# EAGLE design PSPS_AVNC_SRD_sensors-2020-09-29 (EAGLE 9.6.2)
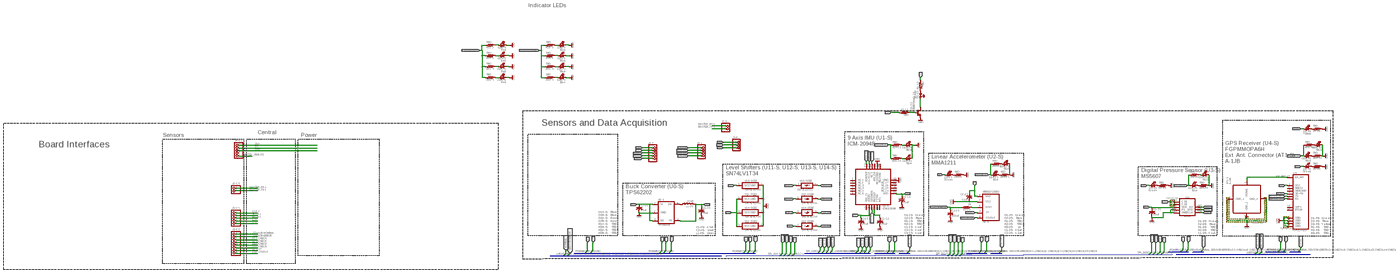
[diagram p0: schematic, sheet 1, overview]
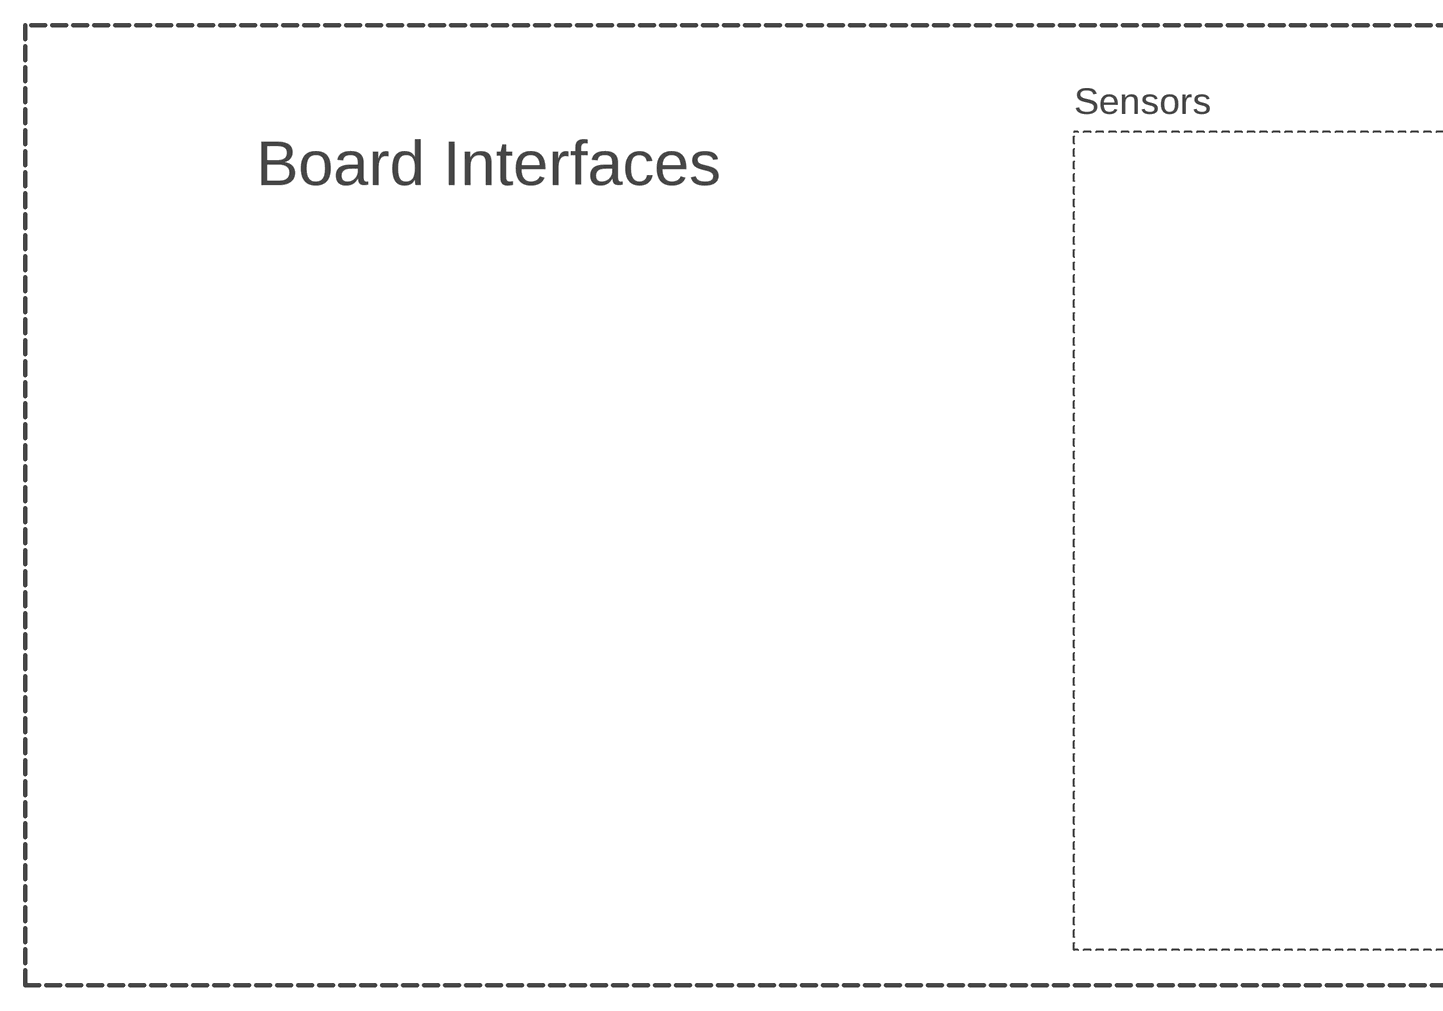
[diagram p1: schematic, sheet 1, part 1 of 4]
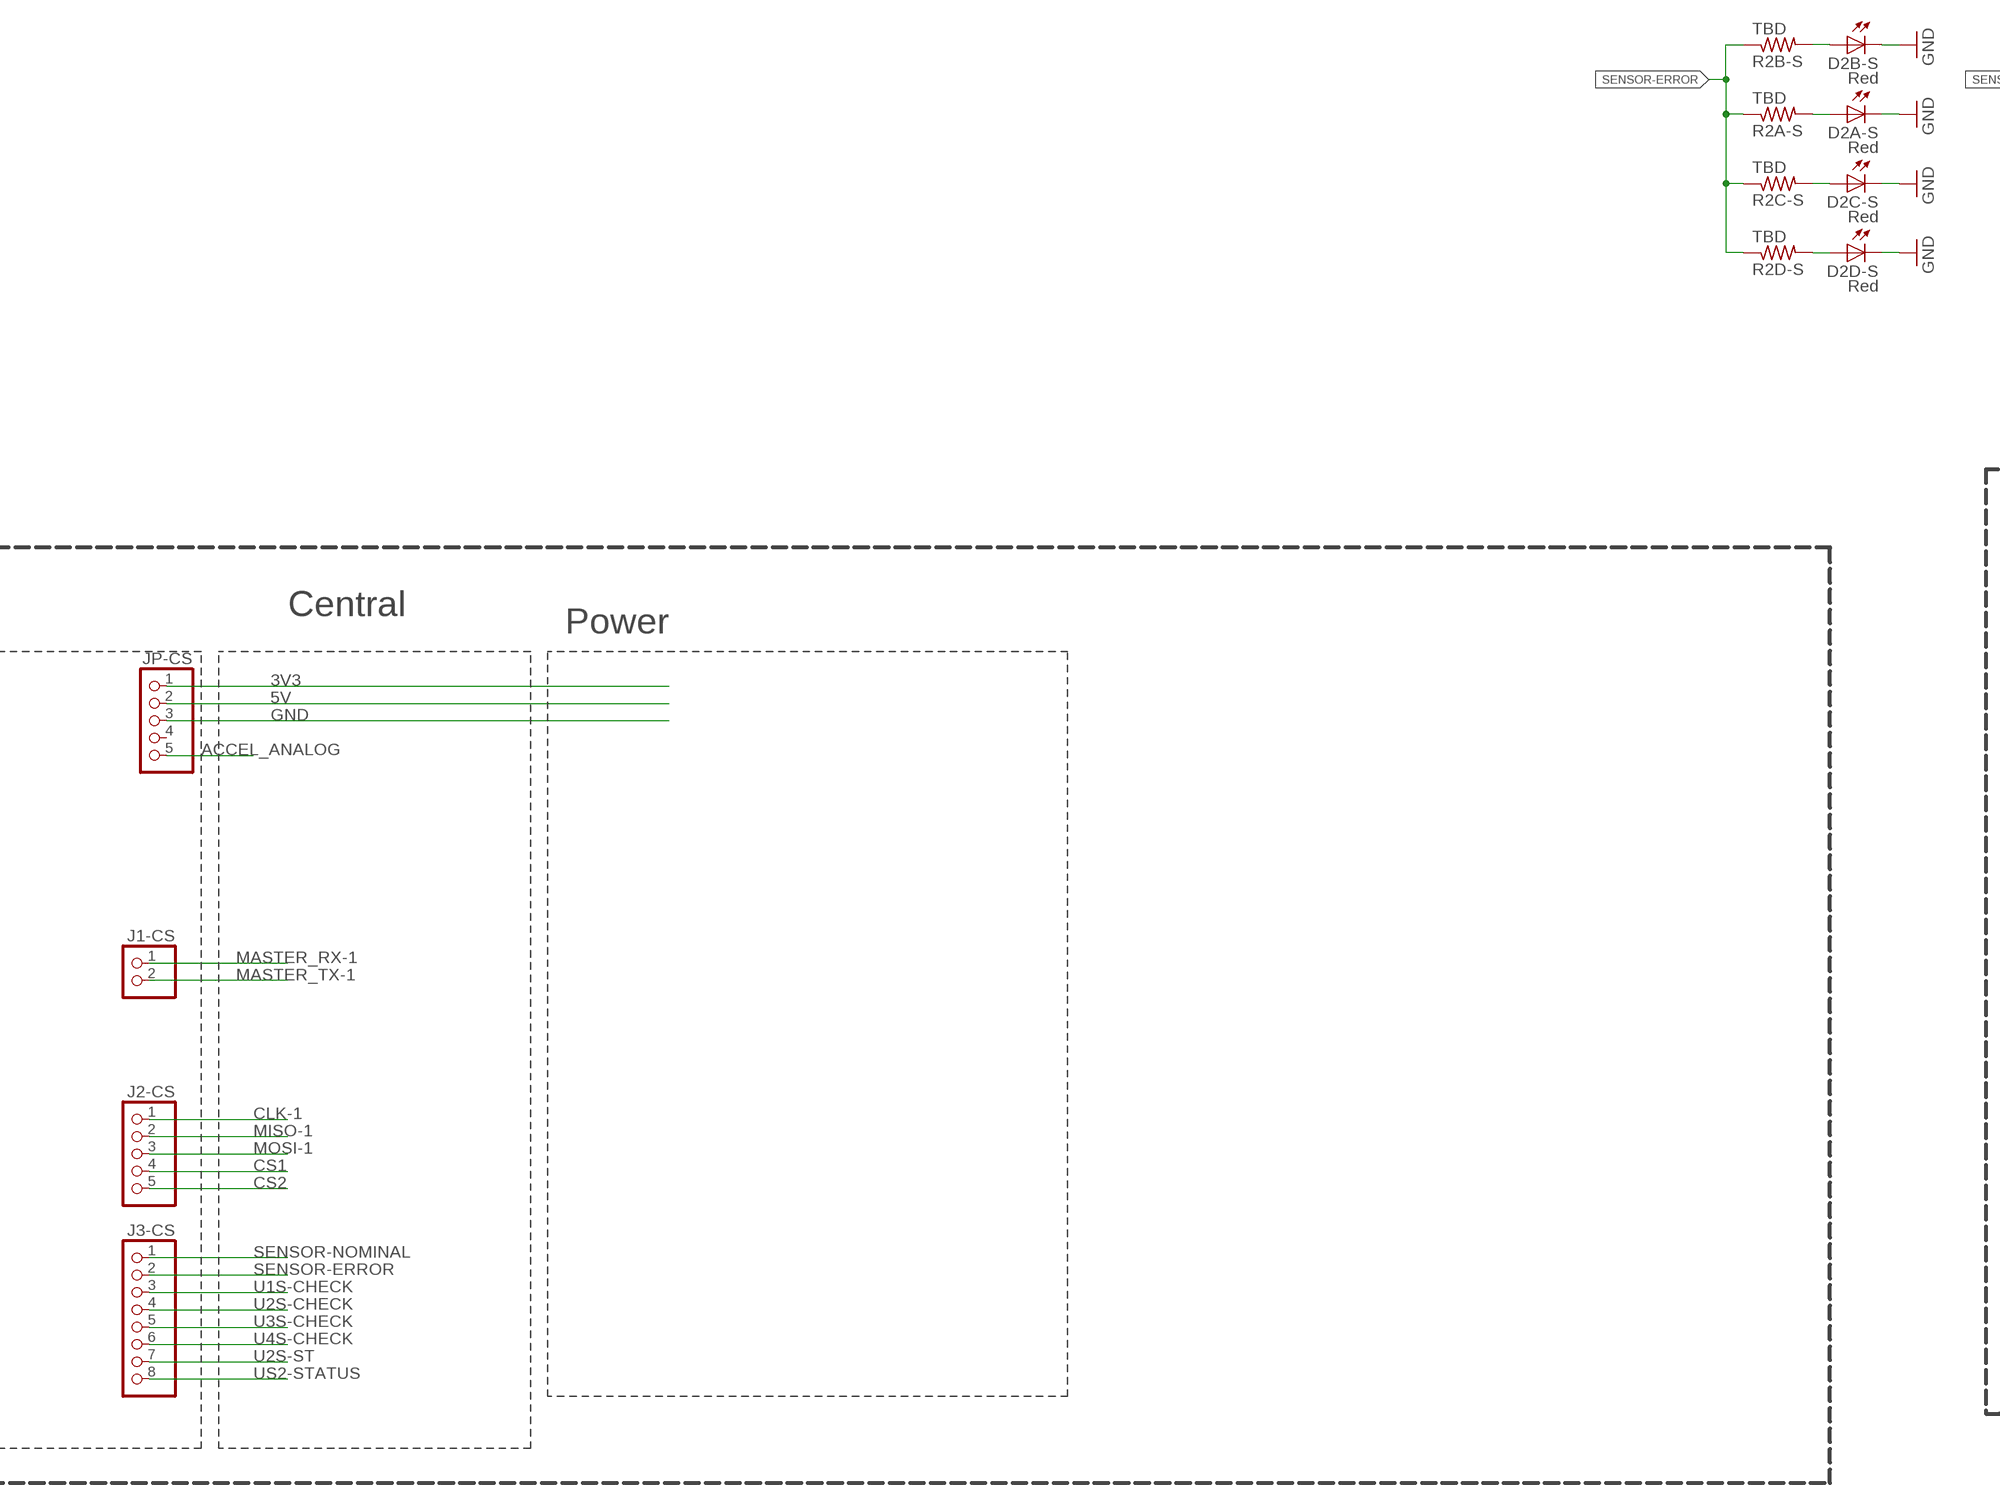
[diagram p2: schematic, sheet 1, part 2 of 4]
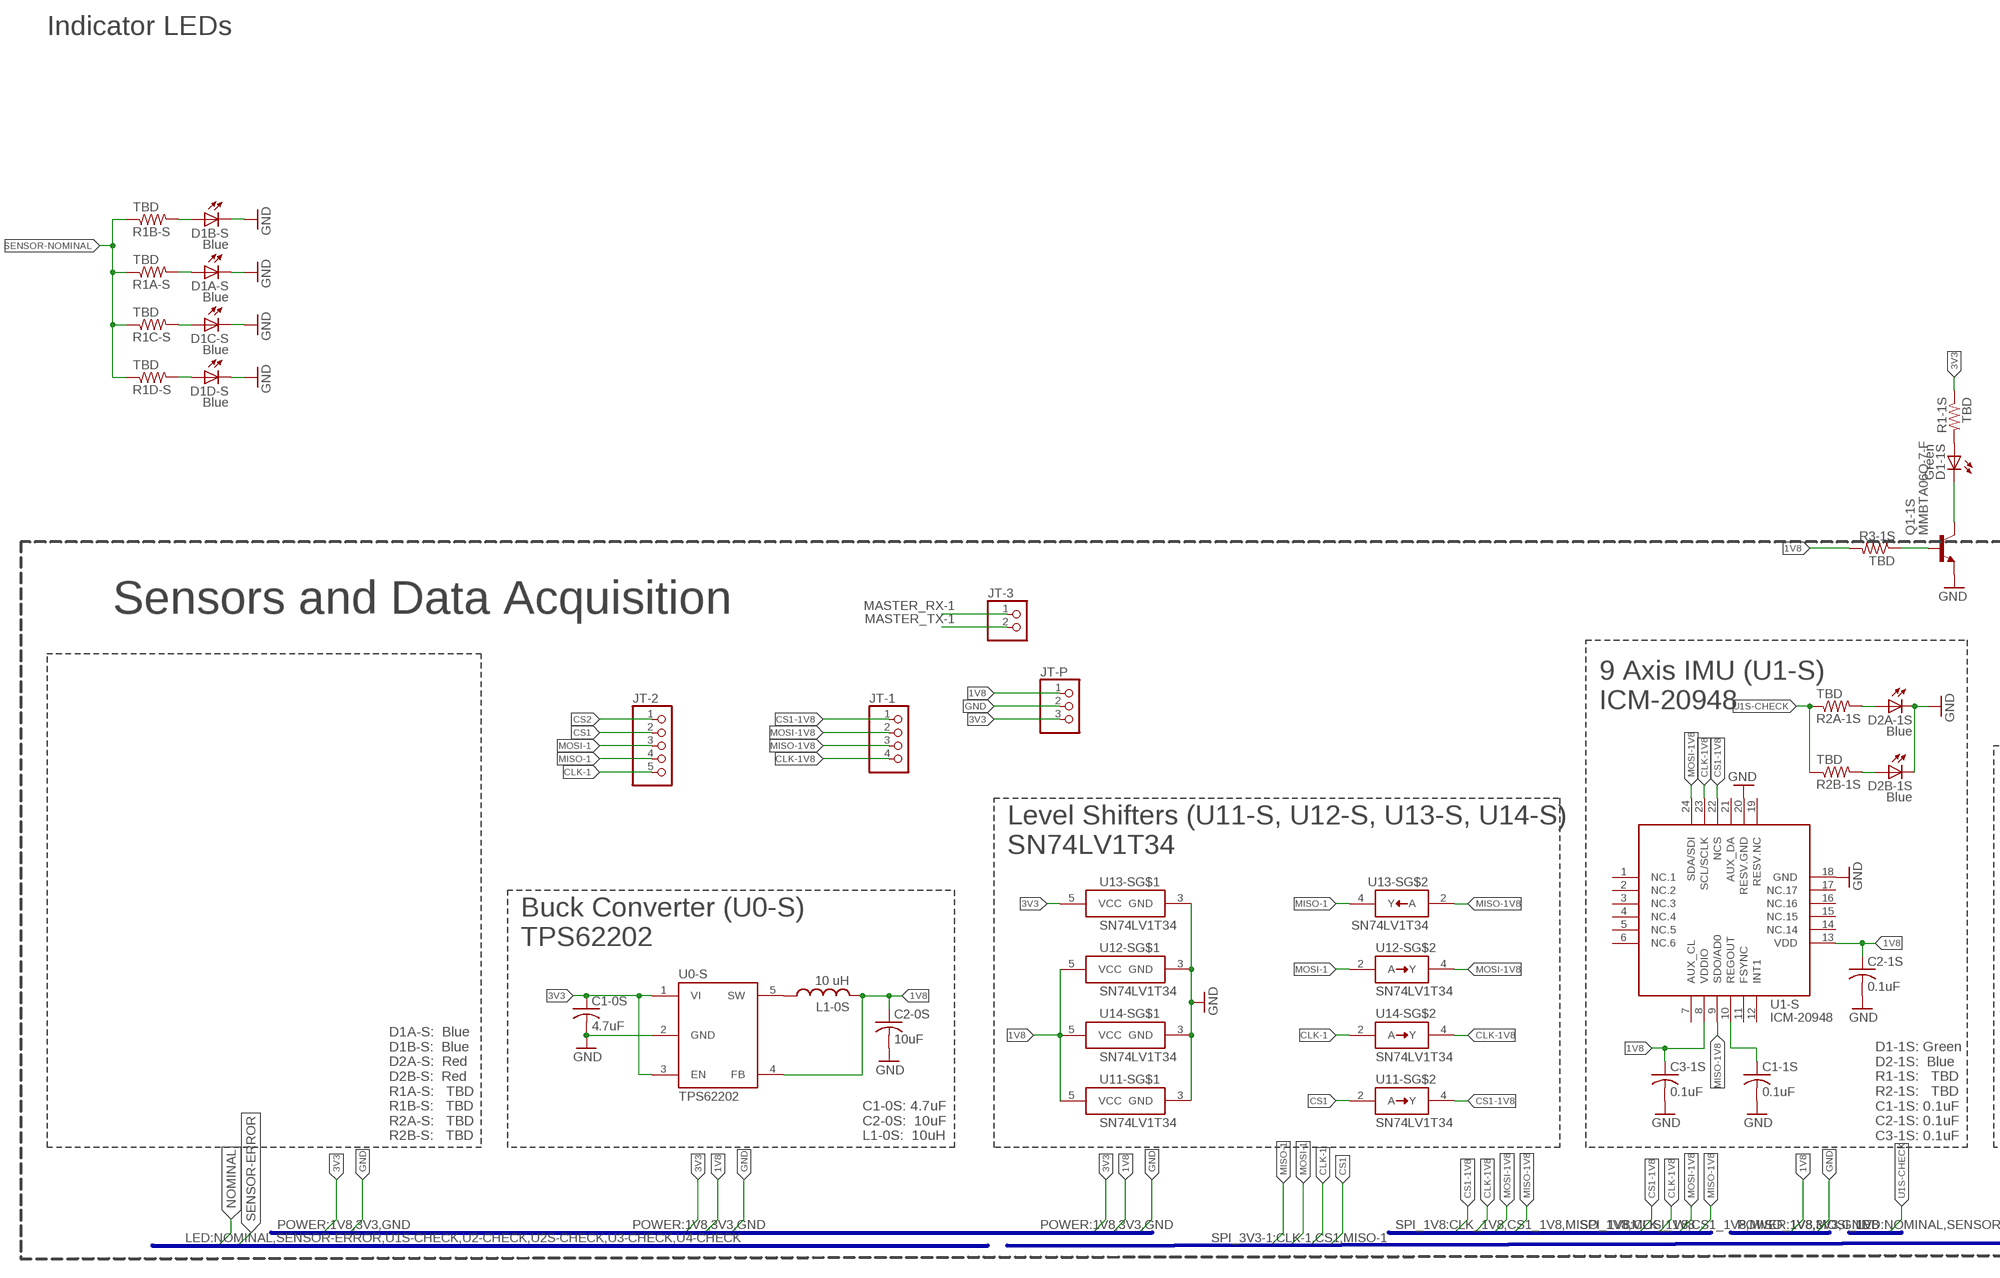
[diagram p3: schematic, sheet 1, part 3 of 4]
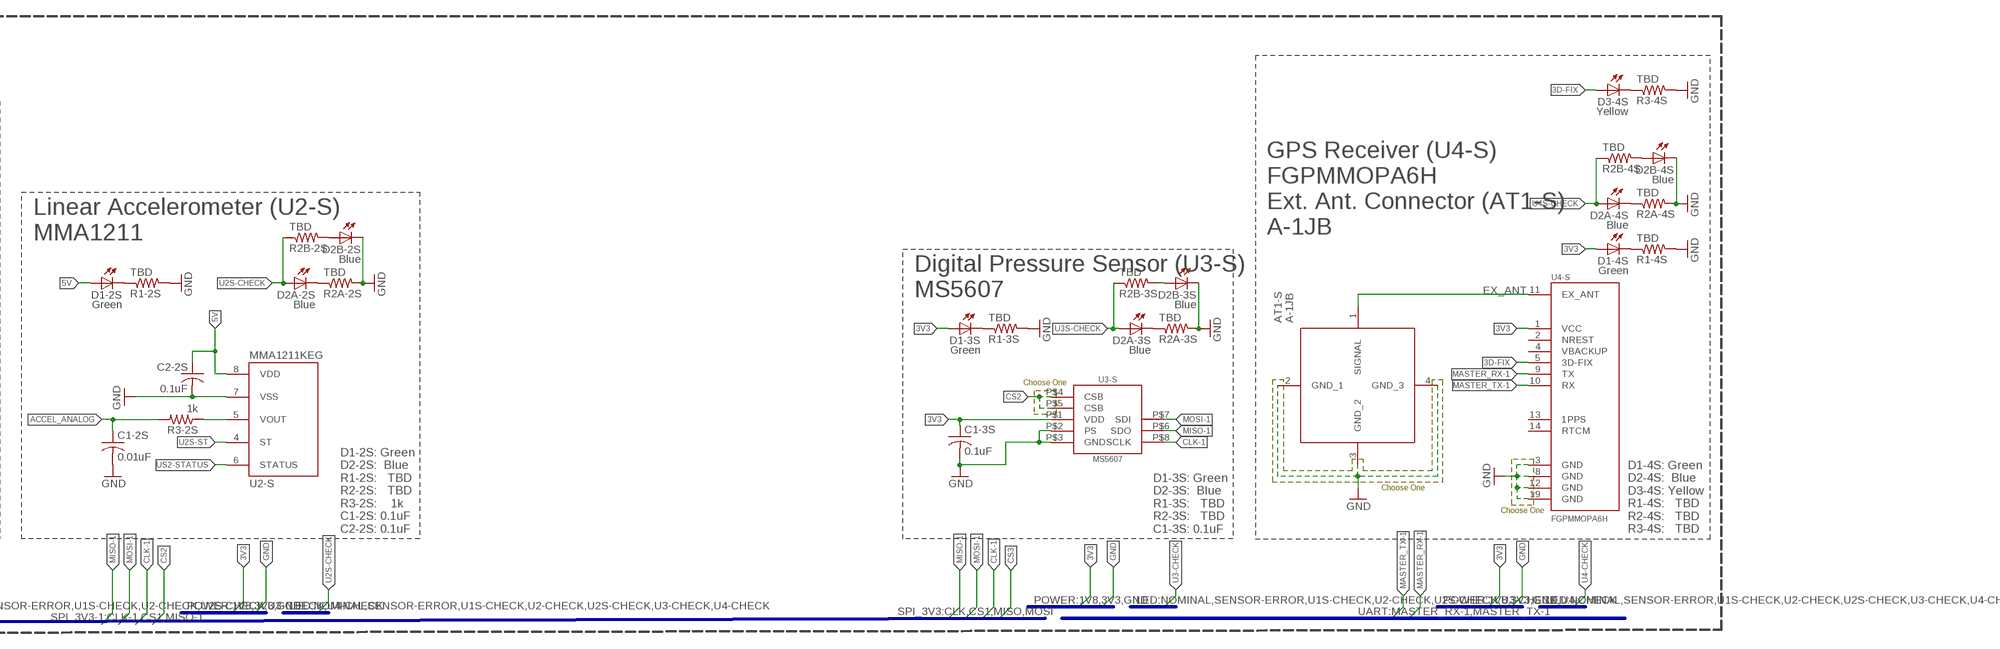
[diagram p4: schematic, sheet 1, part 4 of 4]

## Parts
AT1-S  A-1JB  [A1JB]
C1-0S  4.7uF  C-USC0805  [C0805]
C1-1S  0.1uF  C-USC0805  [C0805]
C1-2S  0.01uF  C-USC0805  [C0805]
C1-3S  0.1uF  C-USC0805  [C0805]
C2-0S  10uF  C-USC0805  [C0805]
C2-1S  0.1uF  C-USC0805  [C0805]
C2-2S  0.1uF  C-USC0805  [C0805]
C3-1S  0.1uF  C-USC0805  [C0805]
D1-1S  Green  LEDCHIPLED_0805  [CHIPLED_0805]
D1-2S  Green  LEDCHIPLED_0805  [CHIPLED_0805]
D1-3S  Green  LEDCHIPLED_0805  [CHIPLED_0805]
D1-4S  Green  LEDCHIPLED_0805  [CHIPLED_0805]
D1A-S  Blue  LEDCHIPLED_0805  [CHIPLED_0805]
D1B-S  Blue  LEDCHIPLED_0805  [CHIPLED_0805]
D1C-S  Blue  LEDCHIPLED_0805  [CHIPLED_0805]
D1D-S  Blue  LEDCHIPLED_0805  [CHIPLED_0805]
D2A-1S  Blue  LEDCHIPLED_0805  [CHIPLED_0805]
D2A-2S  Blue  LEDCHIPLED_0805  [CHIPLED_0805]
D2A-3S  Blue  LEDCHIPLED_0805  [CHIPLED_0805]
D2A-4S  Blue  LEDCHIPLED_0805  [CHIPLED_0805]
D2A-S  Red  LEDCHIPLED_0805  [CHIPLED_0805]
D2B-1S  Blue  LEDCHIPLED_0805  [CHIPLED_0805]
D2B-2S  Blue  LEDCHIPLED_0805  [CHIPLED_0805]
D2B-3S  Blue  LEDCHIPLED_0805  [CHIPLED_0805]
D2B-4S  Blue  LEDCHIPLED_0805  [CHIPLED_0805]
D2B-S  Red  LEDCHIPLED_0805  [CHIPLED_0805]
D2C-S  Red  LEDCHIPLED_0805  [CHIPLED_0805]
D2D-S  Red  LEDCHIPLED_0805  [CHIPLED_0805]
D3-4S  Yellow  LEDCHIPLED_0805  [CHIPLED_0805]
J1-CS  PINHD-1X2  [1X02]
J2-CS  PINHD-1X5  [1X05]
J3-CS  PINHD-1X8  [1X08]
JP-CS  PINHD-1X5  [1X05]
JT-1  PINHD-1X4  [1X04]
JT-2  PINHD-1X5  [1X05]
JT-3  PINHD-1X2  [1X02]
JT-P  PINHD-1X3  [1X03]
L1-0S  10 uH  L-USL1812  [L1812]
Q1-1S  MMBTA06Q-7-F  NPN_TRANSISTOR  [SOT23]
R1-1S  TBD  R-US_R0805  [R0805]
R1-2S  TBD  R-US_R0805  [R0805]
R1-3S  TBD  R-US_R0805  [R0805]
R1-4S  TBD  R-US_R0805  [R0805]
R1A-S  TBD  R-US_R0805  [R0805]
R1B-S  TBD  R-US_R0805  [R0805]
R1C-S  TBD  R-US_R0805  [R0805]
R1D-S  TBD  R-US_R0805  [R0805]
R2A-1S  TBD  R-US_R0805  [R0805]
R2A-2S  TBD  R-US_R0805  [R0805]
R2A-3S  TBD  R-US_R0805  [R0805]
R2A-4S  TBD  R-US_R0805  [R0805]
R2A-S  TBD  R-US_R0805  [R0805]
R2B-1S  TBD  R-US_R0805  [R0805]
R2B-2S  TBD  R-US_R0805  [R0805]
R2B-3S  TBD  R-US_R0805  [R0805]
R2B-4S  TBD  R-US_R0805  [R0805]
R2B-S  TBD  R-US_R0805  [R0805]
R2C-S  TBD  R-US_R0805  [R0805]
R2D-S  TBD  R-US_R0805  [R0805]
R3-1S  TBD  R-US_R0805  [R0805]
R3-2S  1k  R-US_R0805  [R0805]
R3-4S  TBD  R-US_R0805  [R0805]
U0-S  TPS62202  [SOT95P280X145-5]
U1-S  ICM-20948  [QFN40P300X300X105-25T159X175]
U2-S  MMA1211KEG  [SOIC127P1041X355-16N]
U3-S  MS5607  [MS5607]
U4-S  FGPMMOPA6H  [SOIC127P1800X470-20N]
U11-S  SN74LV1T34  [SOT65P210X110-5]
U12-S  SN74LV1T34  [SOT65P210X110-5]
U13-S  SN74LV1T34  [SOT65P210X110-5]
U14-S  SN74LV1T34  [SOT65P210X110-5]

## Nets
1V8: C2-0S.1 C2-1S.1 C3-1S.1 JT-P.1 L1-0S.2 R3-1S.2 U0-S.4(FB) U1-S.8(VDDIO) U1-S.13(VDD) U11-S.5(VCC) U12-S.5(VCC) U14-S.5(VCC)
3D-FIX: D3-4S.A U4-S.5(3D-FIX)
3V3: C1-0S.1 C1-3S.1 D1-3S.A D1-4S.A JP-CS.1 JT-P.3 R1-1S.1 U0-S.1(VI) U0-S.3(EN) U3-S.P$1(VDD) U4-S.1(VCC) U13-S.5(VCC)
5V: C2-2S.1 D1-2S.A JP-CS.2 U2-S.8(VDD)
ACCEL_ANALOG: C1-2S.1 JP-CS.5 R3-2S.2
CLK-1: J2-CS.1 JT-2.5 U3-S.P$8(SCLK) U14-S.2(A)
CLK-1V8: JT-1.4 U1-S.23(SCL/SCLK) U14-S.4(Y)
CS1: J2-CS.4 JT-2.2 U11-S.2(A)
CS1-1V8: JT-1.1 U1-S.22(NCS) U11-S.4(Y)
CS2: J2-CS.5 JT-2.1 U3-S.P$4(CSB) U3-S.P$5(CSB)
D1-2S_R1-2S: D1-2S.C R1-2S.1
D1-3S_R1-3S: D1-3S.C R1-3S.1
D1-4S_R1-4S: D1-4S.C R1-4S.1
D2A-2S_R2A-2S: D2A-2S.C R2A-2S.1
D2A-3S_R2A-3S: D2A-3S.C R2A-3S.1
D2A-4S_R2A-4S: D2A-4S.C R2A-4S.1
D3-4S_R3-4S: D3-4S.C R3-4S.1
EX_ANT: AT1-S.1(SIGNAL) U4-S.11(EX_ANT)
GND: AT1-S.2(GND_1) AT1-S.3(GND_2) AT1-S.4(GND_3) C1-0S.2 C1-1S.2 C1-2S.2 C1-3S.2 C2-0S.2 C2-1S.2 C2-2S.2 C3-1S.2 D1A-S.C D1B-S.C D1C-S.C D1D-S.C D2A-1S.C D2A-S.C D2B-1S.C D2B-2S.C D2B-3S.C D2B-4S.C D2B-S.C D2C-S.C D2D-S.C JP-CS.3 JT-P.2 Q1-1S.3(E) R1-2S.2 R1-3S.2 R1-4S.2 R2A-2S.2 R2A-3S.2 R2A-4S.2 R3-4S.2 U0-S.2(GND) U1-S.18(GND) U1-S.20(RESV.GND) U2-S.7(VSS) U3-S.P$2(PS) U3-S.P$3(GND) U4-S.3(GND) U4-S.8(GND) U4-S.12(GND) U4-S.19(GND) U11-S.3(GND) U12-S.3(GND) U13-S.3(GND) U14-S.3(GND)
MASTER_RX-1: J1-CS.1 JT-3.1 U4-S.9(TX)
MASTER_TX-1: J1-CS.2 JT-3.2 U4-S.10(RX)
MISO-1: J2-CS.2 JT-2.4 U3-S.P$6(SDO) U13-S.4(Y)
MISO-1V8: JT-1.3 U1-S.9(SDO/AD0) U13-S.2(A)
MOSI-1: J2-CS.3 JT-2.3 U3-S.P$7(SDI) U12-S.2(A)
MOSI-1V8: JT-1.2 U1-S.24(SDA/SDI) U12-S.4(Y)
R1-1S_Q1-1S: D1-1S.C Q1-1S.2(C)
R1A-S_D1A-S: D1A-S.A R1A-S.2
R1B-S_D1B-S: D1B-S.A R1B-S.2
R1C-S_D1C-S: D1C-S.A R1C-S.2
R1D-S_D1D-S: D1D-S.A R1D-S.2
R2-1S_D1-1S: D1-1S.A R1-1S.2
R2A-1S_D2A-1S: D2A-1S.A R2A-1S.2
R2A-S_D2A-S: D2A-S.A R2A-S.2
R2B-1S_D2B-1S: D2B-1S.A R2B-1S.2
R2B-2S_D2B-2S: D2B-2S.A R2B-2S.2
R2B-3S_D2B-3S: D2B-3S.A R2B-3S.2
R2B-4S_D2B-4S: D2B-4S.A R2B-4S.2
R2B-S_D2B-S: D2B-S.A R2B-S.2
R2C-S_D2C-S: D2C-S.A R2C-S.2
R2D-S_D2D-S: D2D-S.A R2D-S.2
R3-1S_Q1-1S: Q1-1S.1(B) R3-1S.1
REGOUT: C1-1S.1 U1-S.10(REGOUT)
SENSOR-ERROR: J3-CS.2 R2A-S.1 R2B-S.1 R2C-S.1 R2D-S.1
SENSOR-NOMINAL: J3-CS.1 R1A-S.1 R1B-S.1 R1C-S.1 R1D-S.1
U0S-SW: L1-0S.1 U0-S.5(SW)
U1S-CHECK: J3-CS.3 R2A-1S.1 R2B-1S.1
U2S-CHECK: D2A-2S.A J3-CS.4 R2B-2S.1
U2S-ST: J3-CS.7 U2-S.4(ST)
U3S-CHECK: D2A-3S.A J3-CS.5 R2B-3S.1
U4S-CHECK: D2A-4S.A J3-CS.6 R2B-4S.1
US2-STATUS: J3-CS.8 U2-S.6(STATUS)
VOUT: R3-2S.1 U2-S.5(VOUT)
Unconnected: JP-CS.4 U1-S.1(NC.1) U1-S.2(NC.2) U1-S.3(NC.3) U1-S.4(NC.4) U1-S.5(NC.5) U1-S.6(NC.6) U1-S.7(AUX_CL) U1-S.11(FSYNC) U1-S.12(INT1) U1-S.14(NC.14) U1-S.15(NC.15) U1-S.16(NC.16) U1-S.17(NC.17) U1-S.19(RESV.NC) U1-S.21(AUX_DA) U4-S.2(NREST) U4-S.4(VBACKUP) U4-S.13(1PPS) U4-S.14(RTCM)

## Buses
SPI_3V3:CLK,CS1,MISO,MOSI
SPI_1V8:CLK_1V8,CS1_1V8,MISO_1V8,MOSI_1V8
POWER:1V8,3V3,GND
LED:NOMINAL,SENSOR-ERROR,U1S-CHECK,U2-CHECK,U2S-CHECK,U3-CHECK,U4-CHECK
UART:MASTER_RX-1,MASTER_TX-1
SPI_3V3-1:CLK-1,CS1,MISO-1

## Notes on the sheet
- Indicator LEDs
- Sensors and Data Acquisition
- Central
- Sensors | Power
- 9 Axis IMU (U1-S)
  ICM-20948
- Board Interfaces
- GPS Receiver (U4-S)
  FGPMMOPA6H
  Ext. Ant. Connector (AT1-S)
  A-1JB
- Linear Accelerometer (U2-S)
  MMA1211
- Level Shifters (U11-S, U12-S, U13-S, U14-S)
  SN74LV1T34
- Digital Pressure Sensor (U3-S)
  MS5607
- Buck Converter (U0-S)
  TPS62202
- Choose One
- Choose One
- Choose One
- D1A-S:  Blue
  D1B-S:  Blue
  D2A-S:  Red
  D2B-S:  Red
  R1A-S:   TBD
  R1B-S:   TBD
  R2A-S:   TBD
  R2B-S:   TBD
- C1-0S: 4.7uF
  C2-0S:  10uF
  L1-0S:  10uH
- D1-1S: Green
  D2-1S:  Blue
  R1-1S:   TBD
  R2-1S:   TBD
  C1-1S: 0.1uF
  C2-1S: 0.1uF
  C3-1S: 0.1uF
- D1-2S: Green
  D2-2S:  Blue
  R1-2S:   TBD
  R2-2S:   TBD
  R3-2S:    1k
  C1-2S: 0.1uF
  C2-2S: 0.1uF
- D1-3S: Green
  D2-3S:  Blue
  R1-3S:   TBD
  R2-3S:   TBD
  C1-3S: 0.1uF
- D1-4S: Green
  D2-4S:  Blue
  D3-4S: Yellow
  R1-4S:   TBD
  R2-4S:   TBD
  R3-4S:   TBD

## Library data of the parts
AT1-S = SamacSys_Parts:A-1JB: AMC Straight PCB Jack, Surface Mount Source: Datasheet <https://componentsearchengine.com/Datasheets/1/A-1JB.pdf>; DESCRIPTION: AMC Straight PCB Jack, Surface Mount; HEIGHT: 1.05mm; MANUFACTURER_NAME: Amphenol; MANUFACTURER_PART_NUMBER: A-1JB; MOUSER_PART_NUMBER: 523-A-1JB; MOUSER_PRICE-STOCK: https://www.mouser.com/Search/Refine.aspx?Keyword=523-A-1JB
C1-0S C1-1S C1-2S C1-3S C2-0S C2-1S C2-2S C3-1S = resistor:C-US: CAPACITOR, American symbol
D1-1S D1-2S D1-3S D1-4S D1A-S D1B-S D1C-S D1D-S D2A-1S D2A-2S D2A-3S D2A-4S D2A-S D2B-1S D2B-2S D2B-3S D2B-4S D2B-S D2C-S D2D-S D3-4S = adafruit:LED: LED OSRAM: - CHIPLED LG R971, LG N971, LY N971, LG Q971, LY Q971, LO R971, LY R971 LH N974, LH R974 LS Q976, LO Q976, LY Q976 LO Q996 - Hyper CHIPLED LW Q18S LB Q993, LB Q99A, LB R99A - SideLED LS A670, LO A670, LY A670, LG A670, LP A670 LB A673, LV A673, LT A673, LW A673 LH A674 LY A675 LS A676, LA A676, LO A676, LY A676, LW A676 LS A679, LY A679, LG A679 - Hyper Micro SIDELED® LS Y876, LA Y876, LO Y876, LY Y876 LT Y87S - SmartLED LW L88C, LW L88S LB L89C, LB L89S, LG L890 LS L89K, LO L89K, LY L89K LS L896, LA L896, LO L896, LY L896 - TOPLED LS T670, LO T670, LY T670, LG T670, LP T670 LSG T670, LSP T670, LSY T670, LOP T670, LYG T670 LG T671, LOG T671, LSG T671 LB T673, LV T673, LT T673, LW T673 LH T674 LS T676, LA T676, LO T676, LY T676, LB T676, LH T676, LSB T676, LW T676 LB T67C, LV T67C, LT T67C, LS T67K, LO T67K, LY T67K, LW E67C LS E67B, LA E67B, LO E67B, LY E67B, LB E67C, LV E67C, LT E67C LW T67C LS T679, LY T679, LG T679 LS T770, LO T770, LY T770, LG T770, LP T770 LB T773, LV T773, LT T773, LW T773 LH T774 LS E675, LA E675, LY E675, LS T675 LS T776, LA T776, LO T776, LY T776, LB T776 LHGB T686 LT T68C, LB T68C - Hyper Mini TOPLED® LB M676 - Mini TOPLED Santana® LG M470 LS M47K, LO M47K, LY M47K Source: http://www.osram.convergy.de/
J1-CS JT-3 = pinhead:PINHD-1X2: PIN HEADER
J2-CS JP-CS JT-2 = pinhead:PINHD-1X5: PIN HEADER
J3-CS = pinhead:PINHD-1X8: PIN HEADER
JT-1 = pinhead:PINHD-1X4: PIN HEADER
JT-P = pinhead:PINHD-1X3: PIN HEADER
L1-0S = resistor:L-US: INDUCTOR, American symbol
Q1-1S = Flight Computer Parts:NPN_TRANSISTOR
R1-1S R1-2S R1-3S R1-4S R1A-S R1B-S R1C-S R1D-S R2A-1S R2A-2S R2A-3S R2A-4S R2A-S R2B-1S R2B-2S R2B-3S R2B-4S R2B-S R2C-S R2D-S R3-1S R3-2S R3-4S = resistor:R-US_: RESISTOR, American symbol
U0-S = Computer2:TPS62202: 1.8-V Output, 300-mA, 95% Efficient Step-Down Converter in SOT-23 http://www.ti.com/product/TPS62202
U1-S = Computer2:ICM-20948: 9 Axis Motion Sensor from TDK InvenSense https://store.invensense.com/products/detail/ICM20948-InvenSense/597203/
U2-S = Computer2:MMA1211KEG
U3-S = Computer2:MS5607
U4-S = Computer2:FGPMMOPA6H
U11-S U12-S U13-S U14-S = Computer2:SN74LV1T34: Single Power Supply BUFFER Logic Level Shifter

## Board
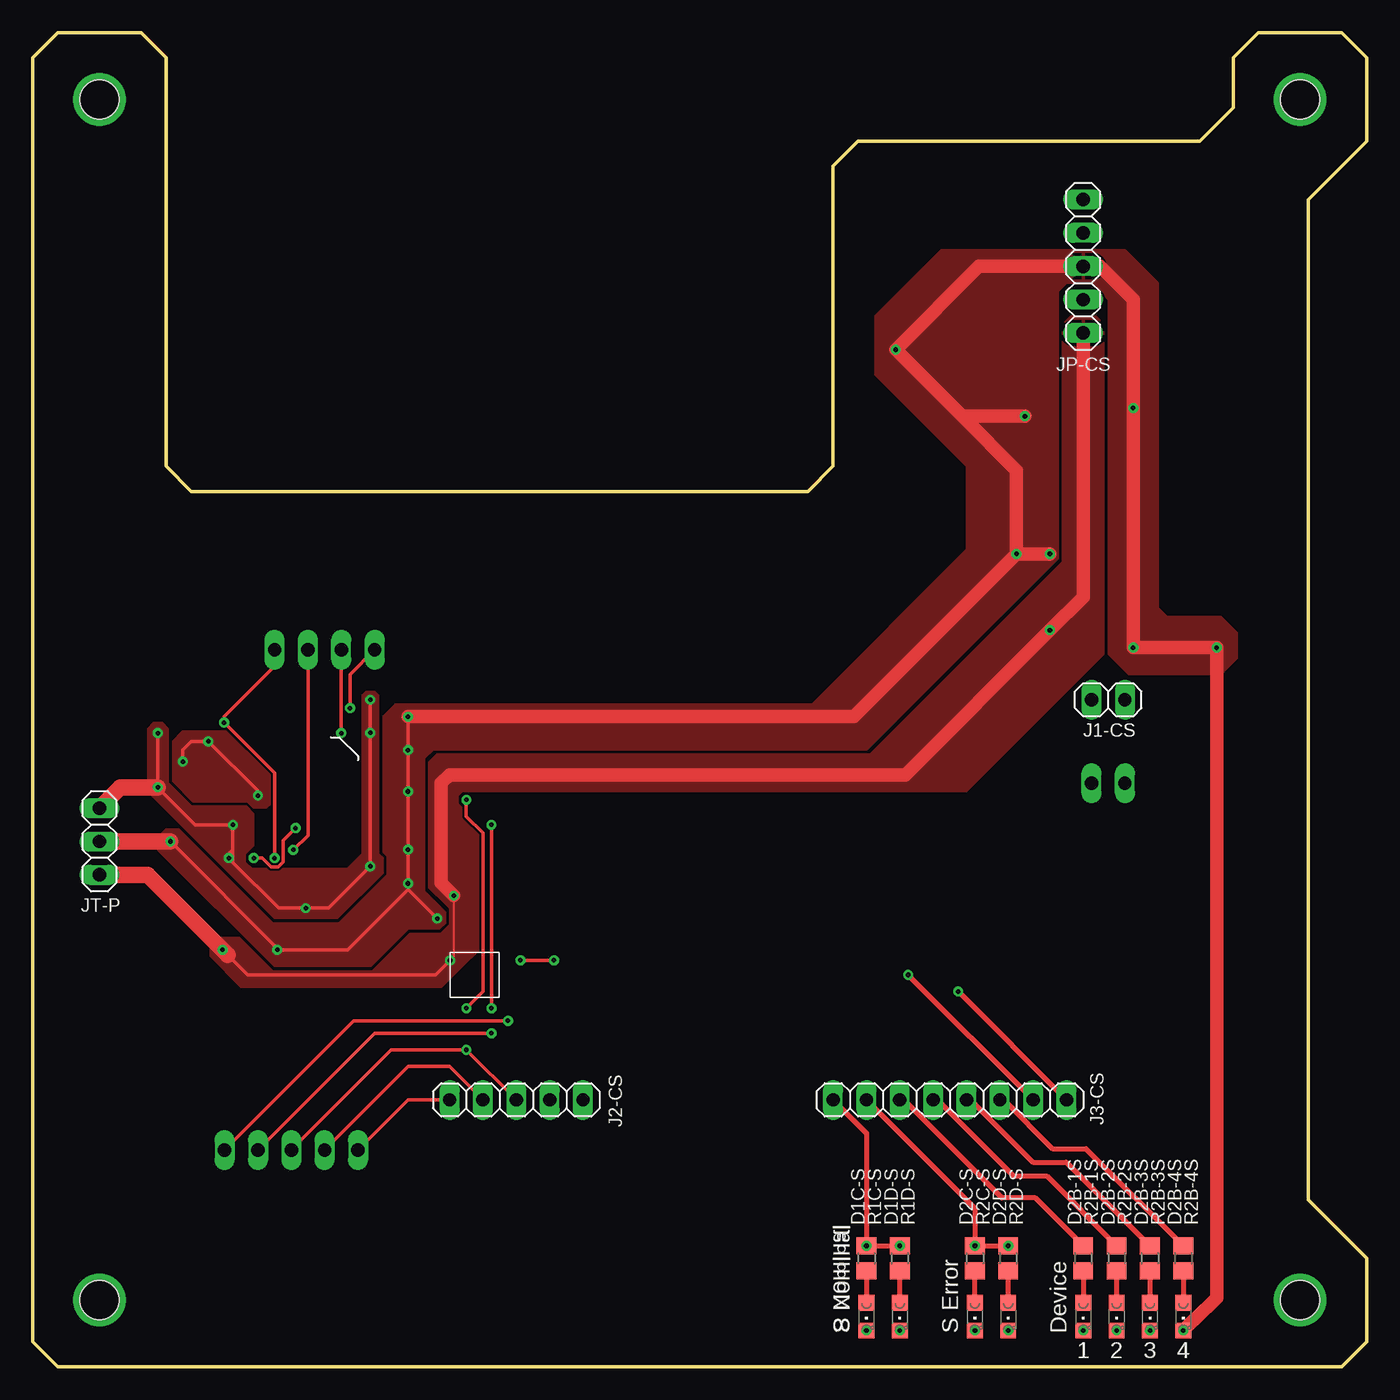
[diagram p5: board, top side]
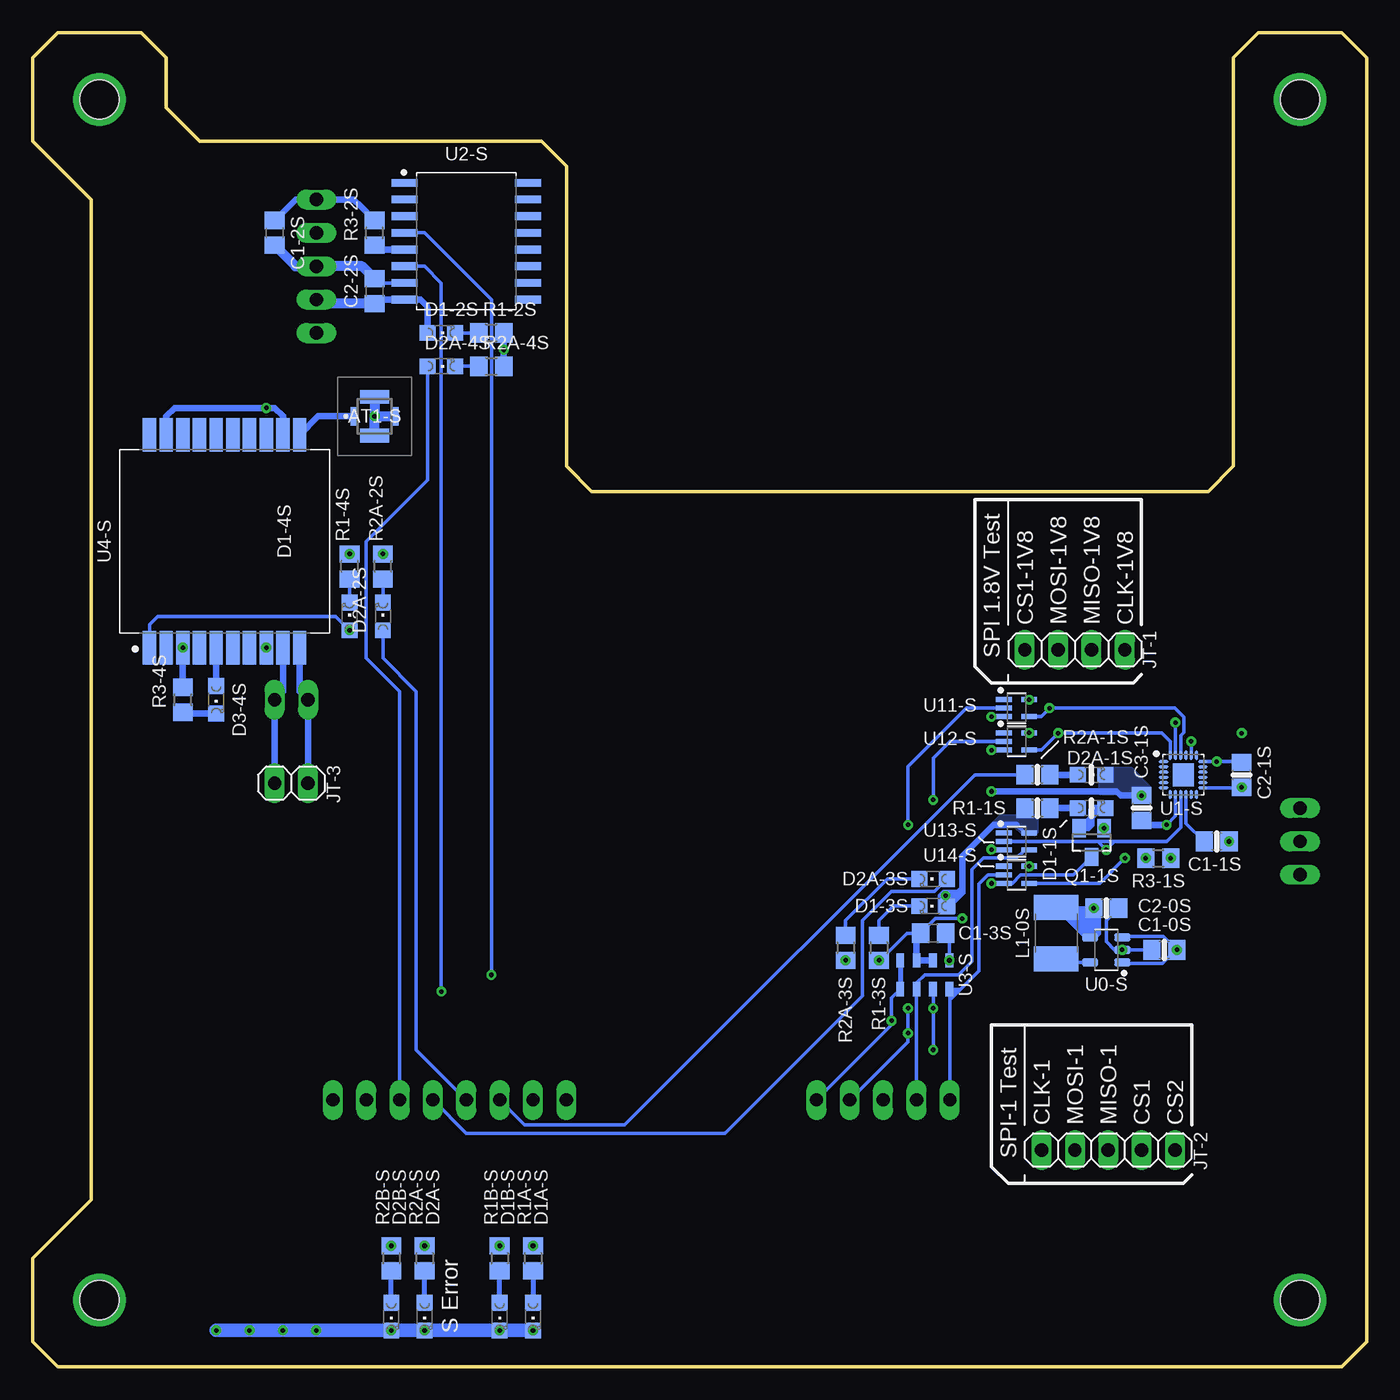
[diagram p6: board, bottom side, seen from below]

Size 101.6 x 101.6 mm. Coordinates in mm from the lower left corner, seen from the top.
Outline: 0,1.91 1.91,0 99.69,0 101.6,1.91 101.6,8.26 97.16,12.7 97.16,88.9 101.6,93.34 101.6,99.69 99.69,101.6 93.34,101.6 91.44,99.69 91.44,95.89 88.9,93.34 62.87,93.34 60.96,91.44 60.96,68.58 59.05,66.67 12.06,66.67 10.16,68.58 10.16,99.69 8.26,101.6 1.91,101.6 0,99.69 0,1.91
Copper layers (1*16): Top 0.035mm / dielectric 1.5mm / Bottom 0.035mm
Design rules "default": minimum track width 6mil, minimum drill 0.35mm, track to track 6mil, track to pad 6mil, pad to pad 6mil, via to via 6mil, smd to smd 6mil, copper to edge 40mil, drill to drill 6mil, minimum pad ring 10mil, minimum via ring 8mil, stop-mask expansion 4mil, vias tented up to drill 0mil, thermal gap 10mil
Holes 3 mm at 5.08,96.52 96.52,96.52 96.52,5.08 5.08,5.08

### Footprints (pad centres in the part's own frame; a part is rotated, then mirrored left to right if it is on the bottom)
A1JB = smd 0.6 x 1.4: 1 1.525,0; 3 -1.525,0 | smd 2.2 x 1.05: 2 0,1.475; 4 0,-1.475
C0805 = smd 1.3 x 1.5: 1 -0.95,0; 2 0.95,0
CHIPLED_0805 = smd 1.2 x 1.2: A 0,-1.05; C 0,1.05
1X02 = drill 1.016 long: 1 -1.27,0; 2 1.27,0
1X05 = drill 1.016 long: 1 -5.08,0; 2 -2.54,0; 3 0,0; 4 2.54,0; 5 5.08,0
1X08 = drill 1.016 long: 1 -8.89,0; 2 -6.35,0; 3 -3.81,0; 4 -1.27,0; 5 1.27,0; 6 3.81,0; 7 6.35,0; 8 8.89,0
1X04 = drill 1.016 long: 1 -3.81,0; 2 -1.27,0; 3 1.27,0; 4 3.81,0
1X03 = drill 1.016 long: 1 -2.54,0; 2 0,0; 3 2.54,0
L1812 = smd 1.9 x 3.4: 1 -1.95,0; 2 1.95,0
SOT23 = smd 1 x 1.4: 1 -0.95,-1.1; 2 0.95,-1.1; 3 0,1.1
R0805 = smd 1.3 x 1.5: 1 -0.95,0; 2 0.95,0
SOT95P280X145-5 = smd 1.259 x 0.609: 1 -1.228,0.95; 2 -1.228,0; 3 -1.228,-0.95; 4 1.228,-0.95; 5 1.228,0.95
QFN40P300X300X105-25T159X175 = smd 0.738 x 0.22: 1 -1.496,1; 2 -1.496,0.6; 3 -1.496,0.2; 4 -1.496,-0.2; 5 -1.496,-0.6; 6 -1.496,-1; 13 1.496,-1; 14 1.496,-0.6; 15 1.496,-0.2; 16 1.496,0.2; 17 1.496,0.6; 18 1.496,1 | smd 0.22 x 0.738: 7 -1,-1.496; 8 -0.6,-1.496; 9 -0.2,-1.496; 10 0.2,-1.496; 11 0.6,-1.496; 12 1,-1.496; 19 1,1.496; 20 0.6,1.496; 21 0.2,1.496; 22 -0.2,1.496; 23 -0.6,1.496; 24 -1,1.496 | smd 1.59 x 1.75: 25 0,0
SOIC127P1041X355-16N = smd 1.973 x 0.589: 1 -4.705,4.445; 2 -4.705,3.175; 3 -4.705,1.905; 4 -4.705,0.635; 5 -4.705,-0.635; 6 -4.705,-1.905; 7 -4.705,-3.175; 8 -4.705,-4.445; 9 4.705,-4.445; 10 4.705,-3.175; 11 4.705,-1.905; 12 4.705,-0.635; 13 4.705,0.635; 14 4.705,1.905; 15 4.705,3.175; 16 4.705,4.445
MS5607 = smd 1.1 x 0.6: P$1 -1.1,1.875; P$2 -1.1,0.625; P$3 -1.1,-0.625; P$4 -1.1,-1.875; P$5 1.1,-1.875; P$6 1.1,-0.625; P$7 1.1,0.625; P$8 1.1,1.875
SOIC127P1800X470-20N = smd 2.54 x 1.016: 1 -8.1,5.715; 2 -8.1,4.445; 3 -8.1,3.175; 4 -8.1,1.905; 5 -8.1,0.635; 6 -8.1,-0.635; 7 -8.1,-1.905; 8 -8.1,-3.175; 9 -8.1,-4.445; 10 -8.1,-5.715; 11 8.1,-5.715; 12 8.1,-4.445; 13 8.1,-3.175; 14 8.1,-1.905; 15 8.1,-0.635; 16 8.1,0.635; 17 8.1,1.905; 18 8.1,3.175; 19 8.1,4.445; 20 8.1,5.715
SOT65P210X110-5 = smd 1.186 x 0.397: 1 -0.962,0.65; 2 -0.962,0; 3 -0.962,-0.65; 4 0.962,-0.65; 5 0.962,0.65

### Placement (x,y rotation side)
AT1-S  75.56,72.39 180 bottom
C1-0S  15.4,31.75 180 bottom
C1-1S  11.43,40.01 0 bottom
C1-2S  83.19,86.36 270 bottom
C1-3S  33.02,33.02 180 bottom
C2-0S  19.84,34.92 0 bottom
C2-1S  9.53,45.09 90 bottom
C2-2S  75.56,81.92 90 bottom
C3-1S  17.14,42.55 90 bottom
D1-1S  20.95,42.55 270 bottom
D1-2S  70.48,78.74 270 bottom
D1-3S  33.02,35.08 90 bottom
D1-4S  77.47,57.15 0 bottom
D1A-S  63.5,3.81 180 bottom
D1B-S  66.04,3.81 180 bottom
D1C-S  63.5,3.81 180 top
D1D-S  66.04,3.81 180 top
D2A-1S  20.95,45.09 270 bottom
D2A-2S  74.93,57.15 0 bottom
D2A-3S  33.02,37.15 90 bottom
D2A-4S  70.48,76.2 270 bottom
D2A-S  71.75,3.81 180 bottom
D2B-1S  80.01,3.81 180 top
D2B-2S  82.55,3.81 180 top
D2B-3S  85.09,3.81 180 top
D2B-4S  87.63,3.81 180 top
D2B-S  74.3,3.81 180 bottom
D2C-S  71.75,3.81 180 top
D2D-S  74.3,3.81 180 top
D3-4S  87.63,50.8 180 bottom
J1-CS  81.92,50.8 180 top
J2-CS  36.83,20.32 0 top
J3-CS  69.85,20.32 0 top
JP-CS  80.01,83.82 90 top
JT-1  22.23,54.61 0 bottom
JT-2  19.68,16.51 180 bottom
JT-3  81.92,44.45 0 bottom
JT-P  5.08,40.01 270 top
L1-0S  23.65,33.02 90 bottom
Q1-1S  20.95,39.93 180 bottom
R1-1S  25.08,42.55 0 bottom
R1-2S  66.67,78.74 0 bottom
R1-3S  37.15,31.91 270 bottom
R1-4S  77.47,60.96 90 bottom
R1A-S  63.5,8.26 270 bottom
R1B-S  66.04,8.26 270 bottom
R1C-S  63.5,8.26 270 top
R1D-S  66.04,8.26 270 top
R2A-1S  25.08,45.09 0 bottom
R2A-2S  74.93,60.96 90 bottom
R2A-3S  39.69,31.91 270 bottom
R2A-4S  66.67,76.2 0 bottom
R2A-S  71.75,8.26 270 bottom
R2B-1S  80.01,8.26 270 top
R2B-2S  82.55,8.26 270 top
R2B-3S  85.09,8.26 270 top
R2B-4S  87.63,8.26 270 top
R2B-S  74.3,8.26 270 bottom
R2C-S  71.75,8.26 270 top
R2D-S  74.3,8.26 270 top
R3-1S  15.88,38.73 0 bottom
R3-2S  75.56,86.36 90 bottom
R3-4S  90.17,50.8 90 bottom
U0-S  19.84,31.75 180 bottom
U1-S  13.97,45.09 0 bottom
U2-S  68.58,85.72 0 bottom
U3-S  33.66,29.84 270 bottom
U4-S  87,62.87 90 bottom
U11-S  26.67,50.16 0 bottom
U12-S  26.67,47.62 0 bottom
U13-S  26.67,40.01 0 bottom
U14-S  26.67,37.47 0 bottom

### Tracks (layer width: path | path; a pad name or v marks a point on that pad's centre or on a via)
1V8  (via drill 0.35)
  Top 0.254: v9.53,48.26 C2-1S.1 12.38,41.27 v15.24,41.27 15.24,39.37 | U14-S.5 U12-S.5 v25.71,50.8 U11-S.5 | 15.24,39.37 15.24,38.41 18.73,34.92 C2-0S.1 22.52,34.92 U14-S.5 | U14-S.5 25.71,38.09 | R3-1S.2 14.93,39.05 15.24,39.37
  Top 1.27: JT-P.1 6.67,44.13 C2-1S.1
  Bottom 0.254: v15.24,41.27 14.57,41.95 U1-S.8 | 17.14,41.27 C3-1S.1 | U1-S.13 9.57,44.09 C2-1S.1 | 21.07,34.65 C2-0S.1 23.61,34.92 L1-0S.2 24.29,34.34 | v25.71,50.8 U11-S.5 | 21.99,33.89 21.91,33.81 21.75,33.81 | U0-S.4 20.91,32.86 20.64,32.86 | U0-S.4 21.23,32.86 21.43,32.86 | U0-S.4 21.27,32.9 21.27,33.18
  Bottom 0.305: 23.34,34.97 L1-0S.2
  Bottom 0.381: C2-0S.1 21.27,34.92 21.43,34.77
  Bottom 0.508: v15.24,41.27 17.14,41.27 | 21.75,33.81 21.75,34.77 | 20.64,32.86 20.48,33.02 20.48,34.45 20.8,34.13 20.8,33.02 | 21.43,34.77 21.43,34.29 21.27,34.13 21.27,33.18 | 21.27,33.02 21.27,33.18 | 21.27,33.18 21.99,33.89 22.07,33.97 | 21.43,32.86 22.86,34.29
  other vias: 25.71,38.12 20.79,34.92 9.53,44.13 25.71,48.27 14.93,38.73
  pour Top: 8.73,48.58 9.21,49.05 9.84,49.05 10.32,48.58 10.32,44.45 12.06,42.7 16.24,42.7 16.83,42.11 16.83,39.69 16.19,39.05 16.19,38.42 16.67,37.94 23.97,37.94 25.08,39.05 25.08,51.12 25.4,51.44 26.04,51.44 26.35,51.12 26.35,39.05 26.67,38.73 26.67,37.62 23.18,34.13 18.41,34.13 8.73,43.81
3D-FIX
  Bottom 0.152: D3-4S.A 87.63,52.07
  Bottom 0.508: 87.63,52.07 U4-S.5
3V3  (via drill 0.35)
  Top 0.152: U3-S.P$1 31.85,31.02 32.07,31.23 v32.07,35.88
  Top 0.254: C1-0S.1 14.84,31.35 16.35,29.84 30.68,29.84 31.85,31.02
  Top 1.016: JP-CS.1 80.01,58.64 D1-4S.A 66.45,45.09 31.75,45.09 31.11,44.45 31.11,36.83 v32.07,35.88
  Top 1.27: JT-P.3 8.73,37.47 14.84,31.35
  Bottom 0.152: D1-3S.A 31.97,35.24
  Bottom 0.254: U0-S.3 18.54,32.78 15.48,32.78 C1-0S.1 14.55,31.75 15.58,30.72 18.54,30.72 U0-S.1 | U4-S.1 92.71,56.52 92.08,57.15 78.52,57.15 D1-4S.A | C1-3S.1 31.78,32.73 U3-S.P$1 31.73,30.95 | U13-S.5 26.05,40.66 26.67,41.27 | 31.67,35.24 31.97,35.24 | D1-3S.A 32.07,35.18 32.07,35.56 32.07,35.72 31.59,35.72 31.11,36.2 32.23,36.2 32.54,35.88 32.54,34.57 31.43,34.57 31.43,35.72 | v32.07,35.88 31.35,35.88 | 31.59,36.04 32.07,36.04 32.38,35.72
  Bottom 0.381: v32.07,35.88 32.07,35.72 | v32.07,35.88 32.07,35.56 | v32.07,35.88 32.23,35.72 32.38,35.72
  Bottom 0.508: 26.67,41.27 28.44,41.27 30.8,38.91 30.8,36.43 | 30.8,36.43 30.8,36.12 31.67,35.24 | 31.35,35.88 30.8,36.43
  other vias: 14.45,31.75 31.78,30.95 77.47,56.1
  pour Top: 15.72,32.7 13.97,32.7 13.49,32.23 13.49,31.27 15.88,28.89 31.11,28.89 32.7,30.48 32.7,36.2 32.38,36.51 31.75,36.51 31.43,36.2 31.43,35.24 31.75,34.92 31.75,33.66 31.11,33.02 28.73,33.02 25.88,30.16 18.26,30.16
  pour Bottom (no thermals): 25.24,40.72 25.24,41.67 25.4,41.83 27.86,41.83 28.42,41.27 26.75,41.27 26.11,40.64 25.32,40.64
  pour Top: 31.43,35.24 30.16,36.51 30.16,46.04 30.8,46.67 63.82,46.67 78.42,61.28 78.42,79.38 79.06,80.01 80.96,80.01 81.6,79.38 81.6,54.29 71.12,43.81 32.7,43.81 32.38,43.5 32.38,42.86 33.02,42.23 33.02,41.59 33.97,40.64 33.97,31.75 32.7,30.48 32.38,30.8 32.38,34.92 32.07,35.24
5V
  Bottom 0.254: 75.41,81.12 C2-2S.1 | 71.53,80.64 71.53,80.74 71.6,80.8
  Bottom 0.381: D1-2S.A 71.53,79.38
  Bottom 0.508: 71.53,79.38 71.53,80.64 | 71.6,80.8 72.07,81.28 U2-S.8 75.25,81.28 75.41,81.12
  Bottom 0.762: C2-2S.1 79.69,80.97 JP-CS.2
ACCEL_ANALOG
  Bottom 0.508: R3-2S.2 76.68,88.42 77.16,88.9 JP-CS.5 81.59,88.9 C1-2S.1
CLK-1
  Top 0.254: J2-CS.1 28.57,20.32 JT-2.5
  Bottom 0.254: U14-S.2 28.85,37.47 29.53,36.78 29.53,30.16 30.95,28.75 | 31.78,20.35 J2-CS.1 31.75,27.94 | U3-S.P$8 31.78,29.18 | 30.95,28.75 U3-S.P$8 | 31.75,27.94 31.75,28.71 U3-S.P$8 | 31.75,27.94 30.95,28.75 | 31.59,28.42 31.27,28.73
  Bottom 0.381: U3-S.P$8 31.78,28.61 31.59,28.42
CLK-1V8  (via drill 0.35)
  Top 0.254: v18.41,38.73 18.41,45.21 v14.57,49.05 14.57,49.53 18.41,53.38 JT-1.4
  Bottom 0.254: U14-S.4 20.34,36.81 v18.41,38.73 | U1-S.23 v14.57,49.05
CS1  (via drill 0.35)
  Top 0.254: JT-2.2 26.04,25.4 v34.94,25.4 | v34.94,27.3 34.92,27.32 v34.92,41.27
  Bottom 0.254: U11-S.2 30.48,50.16 34.92,45.72 v34.92,41.27 | J2-CS.4 34.94,24.75 v34.94,25.4 v34.94,27.3
CS1-1V8  (via drill 0.35)
  Top 0.254: v24.15,50.16 24.15,52.73 JT-1.1
  Bottom 0.254: U11-S.4 24.78,49.52 24.13,50.16 | 24.13,50.16 14.61,50.16 13.91,49.47 13.91,48.32 14.17,48.06 U1-S.22 | 24.13,50.16 v24.15,50.16
CS2  (via drill 0.35)
  Top 0.254: JT-2.1 24.45,26.35 v36.2,26.35
  Bottom 0.254: J2-CS.5 36.2,26.04 v36.2,26.35 36.2,28.08 U3-S.P$5
  Bottom 0.381: U3-S.P$4 U3-S.P$5
D1-2S_R1-2S
  Bottom 0.254: D1-2S.C R1-2S.1
D1-3S_R1-3S
  Bottom 0.254: D1-3S.C 36.04,35.08 37.15,33.97 R1-3S.1
D1-4S_R1-4S
  Bottom 0.254: R1-4S.1 D1-4S.C
D2A-2S_R2A-2S
  Bottom 0.254: R2A-2S.1 D2A-2S.C
D2A-3S_R2A-3S
  Bottom 0.152: R2A-3S.1 39.69,33.02
  Bottom 0.254: D2A-3S.C 36.51,37.15 39.69,33.97 39.69,33.02
D2A-4S_R2A-4S
  Bottom 0.254: D2A-4S.C R2A-4S.1
D3-4S_R3-4S
  Bottom 0.508: D3-4S.C 90.07,49.75 R3-4S.1
EX_ANT
  Bottom 0.508: AT1-S.1 79.86,72.39 U4-S.11
GND  (via drill 0.35)
  Top 0.254: v11.43,46.09 11.43,46.99 12.06,47.62 v13.37,47.62 | 13.02,47.62 v13.37,47.62 | v13.37,47.62 17.12,43.87 17.12,43.49 v17.14,43.49 | v28.57,49.51 v28.57,46.97 v28.57,43.81 v28.57,39.39 v28.57,36.81 28.57,36.35 | v30.8,34.13 28.57,36.35 | 10.64,39.85 18.62,31.87 U0-S.2 23.97,31.75 28.57,36.35 | R1-3S.2 R2A-3S.2
  Top 0.508: C1-1S.2 10.64,39.85
  Top 0.762: JP-CS.3 81.28,83.82
  Top 1.016: 81.28,83.82 83.82,81.28 v83.82,73.03 U4-S.8 U4-S.3 90.17,5.27 88.5,3.6 88.47,3.6 D2B-4S.C | v28.57,49.51 62.53,49.51 R2A-2S.2 | R2A-2S.2 R1-4S.2 | R2A-2S.2 74.93,68.27 70.81,72.39 | 70.81,72.39 v65.72,77.47 72.08,83.82 JP-CS.3 | v75.56,72.39 70.81,72.39
  Top 1.27: JT-P.2 C1-1S.2
  Bottom 0.152: U14-S.3 v28.57,36.81 | U13-S.3 27.67,39.39 v28.57,39.39 | U12-S.3 v28.57,46.98 v28.57,46.97 | U11-S.3 v28.57,49.52 v28.57,49.51
  Bottom 0.254: U1-S.18 v11.43,46.09 9.53,46.09 C2-1S.2 | U1-S.20 v13.37,47.62 | C2-0S.2 19.84,33.98 19.84,32.38 19.21,31.75 U0-S.2 C1-0S.2 | C2-2S.2 75.25,82.55 U2-S.7 | 34.28,32.7 34.28,32.71 | v30.8,34.13 32.86,34.13 C1-3S.2 35.01,33.02 37.07,30.96 | U14-S.3 27,36.81 26.36,37.46 22.32,37.46 Q1-1S.3
  Bottom 0.381: U4-S.3 90.17,54.61
  Bottom 0.508: v28.57,43.81 19.05,43.81 18.73,43.49 v17.14,43.49 | U3-S.P$2 U3-S.P$3 34.28,32.71 C1-3S.2 | R1-2S.2 v65.72,77.47 R2A-4S.2 | U4-S.12 82.55,72.39 83.19,73.03 v83.82,73.03 90.81,73.03 91.44,72.39 U4-S.19 | R1-3S.2 37.07,30.96 | R3-4S.2 90.17,54.61 90.17,55.24
  Bottom 0.762: AT1-S.4 v75.56,72.39 | AT1-S.2 v75.56,72.39 | v75.56,72.39 AT1-S.3 | C2-2S.2 76.52,83.82 JP-CS.3 81.59,83.82 C1-2S.2
  Bottom 1.016: D2B-4S.C D2B-3S.C D2B-2S.C D2B-1S.C D2D-S.C D2C-S.C D1B-S.C D1A-S.C
  other vias: 10.48,40.01 37.15,30.96 39.69,30.96 18.62,31.75 83.82,54.77 90.17,54.77 74.93,61.91 77.47,61.91 71.75,2.76 74.3,2.76 66.04,2.76 63.5,2.76 80.01,2.76 82.55,2.76 85.09,2.76 87.63,2.76
  pour Top: 10.64,47.62 10.64,44.61 12.22,43.02 16.35,43.02 16.83,42.55 17.78,42.55 18.1,42.86 18.1,45.24 14.92,48.42 11.43,48.42
  pour Bottom (no thermals): 16.51,43.66 20.32,43.66 20.32,45.56 17.94,45.56 16.51,44.13
  pour Top: 11.11,40.96 10.16,40.96 9.53,40.32 9.53,39.37 18.41,30.48 25.72,30.48 28.57,33.34 30.96,33.34 31.43,33.81 31.43,34.61 29.84,36.2 29.84,49.53 28.89,50.48 27.62,50.48 26.67,49.53 26.67,39.21 26.99,38.89 26.99,37.47 23.34,33.81 18.26,33.81
  pour Top (no thermals): 27.62,50.48 59.37,50.48 71.12,62.23 71.12,68.58 64.14,75.56 64.14,80.01 69.22,85.09 78.74,85.09 79.38,84.45 79.38,83.19 78.11,81.92 78.11,61.59 63.5,46.99 30.48,46.99 29.84,46.35 27.94,46.35 26.67,47.62 26.67,49.53
  pour Top: 78.74,82.55 80.64,82.55 81.92,81.28 81.92,54.29 83.5,52.7 90.49,52.7 91.76,53.98 91.76,55.88 90.49,57.15 86.36,57.15 85.72,57.78 85.72,82.55 83.19,85.09 78.74,85.09 78.11,84.45 78.11,83.19
MASTER_RX-1
  Bottom 0.508: U4-S.9 82.55,51.44 J1-CS.1 JT-3.1
MASTER_TX-1
  Bottom 0.508: U4-S.10 81.28,51.44 J1-CS.2 JT-3.2
MISO-1
  Top 0.254: J2-CS.2 31.75,22.86 28.57,22.86 JT-2.4
  Bottom 0.254: U13-S.4 26.05,39.35 26.67,38.73 29.21,38.73 30.08,37.86 30.08,30.88 31.11,29.84 33.66,29.84 34.28,29.22 U3-S.P$6 J2-CS.2
MISO-1V8  (via drill 0.35)
  Top 0.254: v19.84,39.37 20.95,40.48 JT-1.3
  Bottom 0.152: v19.84,39.37 19.53,39.69 19.53,39.85
  Bottom 0.254: 19.21,40.01 15.24,40.01 14.17,41.08 U1-S.9 | 19.21,40.01 20.48,40.01 | U13-S.2 20.48,40.01 | 20.48,40.01 v19.84,39.37 19.21,40.01
MOSI-1  (via drill 0.35)
  Top 0.254: JT-2.3 27.3,24.13 v33.02,24.13 J2-CS.3 | v33.02,27.3 34.29,28.57 34.29,40.64 33.02,41.91 v33.02,43.18
  Bottom 0.254: U12-S.2 31.75,47.62 33.02,46.35 v33.02,43.18 | U3-S.P$7 v33.02,27.3 v33.02,24.13
MOSI-1V8  (via drill 0.35)
  Top 0.254: JT-1.2 v23.5,48.26
  Bottom 0.254: U12-S.4 24.78,46.98 v23.5,48.26 15.61,48.26 14.97,47.62 U1-S.24
  pour Bottom: 19.84,39.37 19.21,40.01 20.48,40.01
N$1  (via drill 3 pad 4)
  other vias: 5.08,5.08
N$3  (via drill 3 pad 4)
  other vias: 5.08,96.52
N$4  (via drill 3 pad 4)
  other vias: 96.52,96.52
N$5  (via drill 3 pad 4)
  other vias: 96.52,5.08
R1-1S_Q1-1S
  Bottom 0.254: Q1-1S.2 21.84,41.03
  Bottom 0.483: 20.24,42.55 21.91,40.88
  Bottom 0.508: Q1-1S.2 21.2,41.03 20.95,41.27 20.95,42.39 20.8,42.55 20.24,42.55 D1-1S.C
R1A-S_D1A-S
  Bottom 0.381: R1A-S.2 D1A-S.A
R1B-S_D1B-S
  Bottom 0.381: D1B-S.A R1B-S.2
R1C-S_D1C-S
  Top 0.381: R1C-S.2 D1C-S.A
R1D-S_D1D-S
  Top 0.381: D1D-S.A R1D-S.2
R2-1S_D1-1S
  Bottom 0.508: D1-1S.A R1-1S.2
R2A-1S_D2A-1S
  Bottom 0.508: D2A-1S.A R2A-1S.2
R2A-S_D2A-S
  Bottom 0.381: D2A-S.A R2A-S.2
R2B-1S_D2B-1S
  Top 0.381: R2B-1S.2 D2B-1S.A
R2B-2S_D2B-2S
  Top 0.381: R2B-2S.2 D2B-2S.A
R2B-3S_D2B-3S
  Top 0.381: R2B-3S.2 D2B-3S.A
R2B-4S_D2B-4S
  Top 0.381: R2B-4S.2 D2B-4S.A
R2B-S_D2B-S
  Bottom 0.381: D2B-S.A R2B-S.2
R2C-S_D2C-S
  Top 0.381: D2C-S.A R2C-S.2
R2D-S_D2D-S
  Top 0.381: D2D-S.A R2D-S.2
R3-1S_Q1-1S  (via drill 0.35)
  Top 0.254: R3-1S.1 17.48,38.73 18.14,38.08 18.69,38.08 19.07,38.46 19.07,40.09 Q1-1S.1
  other vias: 20,41.03 16.82,38.73
REGOUT
  Bottom 0.254: U1-S.10 13.77,41.4 C1-1S.1
SENSOR-ERROR  (via drill 0.35)
  Top 0.381: J3-CS.2 71.75,12.06 R2C-S.1 R2D-S.1
  other vias: 74.3,9.21 71.75,9.21
SENSOR-NOMINAL  (via drill 0.35)
  Top 0.254: R1A-S.1 63.19,9.21
  Top 0.381: J3-CS.1 63.5,17.78 R1A-S.1 R1B-S.1
  other vias: 66.04,9.21 63.5,9.21
U0S-SW
  Bottom 0.254: U0-S.5 23.38,30.8 L1-0S.1
U1S-CHECK
  Top 0.254: 66.34,20.32 J3-CS.3
  Top 0.381: R2B-1S.1 76.36,12.85 73.81,12.85 66.34,20.32
  Bottom 0.254: R2A-1S.1 29.84,45.09 56.52,18.41 64.14,18.41 J3-CS.3
U2S-CHECK
  Top 0.254: J3-CS.4 68.89,20.32
  Top 0.381: R2B-2S.1 77.23,14.53 74.68,14.53 68.89,20.32
  Bottom 0.254: D2A-2S.A 74.93,53.98 72.39,51.44 72.39,24.13 J3-CS.4
U2S-ST  (via drill 0.35)
  Top 0.381: J3-CS.7 v66.67,29.84
  Bottom 0.254: U2-S.4 71.75,86.36 66.67,81.28 v66.67,29.84
U3S-CHECK
  Top 0.254: J3-CS.5 71.42,20.32
  Top 0.381: R2B-3S.1 78.72,15.57 76.17,15.57 71.42,20.32
  Bottom 0.254: D2A-3S.A 32.92,36.2 36.2,36.2 38.42,33.97 38.42,28.26 48.9,17.78 68.58,17.78 J3-CS.5
U4S-CHECK
  Top 0.254: J3-CS.6 73.97,20.32
  Top 0.381: R2B-4S.1 80.22,16.61 77.67,16.61 73.97,20.32
  Bottom 0.254: D2A-4S.A 71.53,67.53 76.2,62.87 76.2,53.98 73.66,51.44 J3-CS.6
US2-STATUS  (via drill 0.35)
  Top 0.381: J3-CS.8 v70.48,28.57
  Bottom 0.254: U2-S.6 71.75,83.82 70.48,82.55 v70.48,28.57
VOUT
  Bottom 0.254: 75.41,85.25 R3-2S.1
  Bottom 0.508: U2-S.5 75.25,85.09 75.41,85.25

### Text on the board
tNames: S Nominal | S Nominal | S Error | Device | 1 | 2 | 3 | 4
bNames: CLK-1V8 | MISO-1V8 | MOSI-1V8 | CS1-1V8 | SPI 1.8V Test | CS2 | CS1 | MISO-1 | MOSI-1 | CLK-1 | SPI-1 Test | S Error